# EAGLE design main (EAGLE 8.3.1)
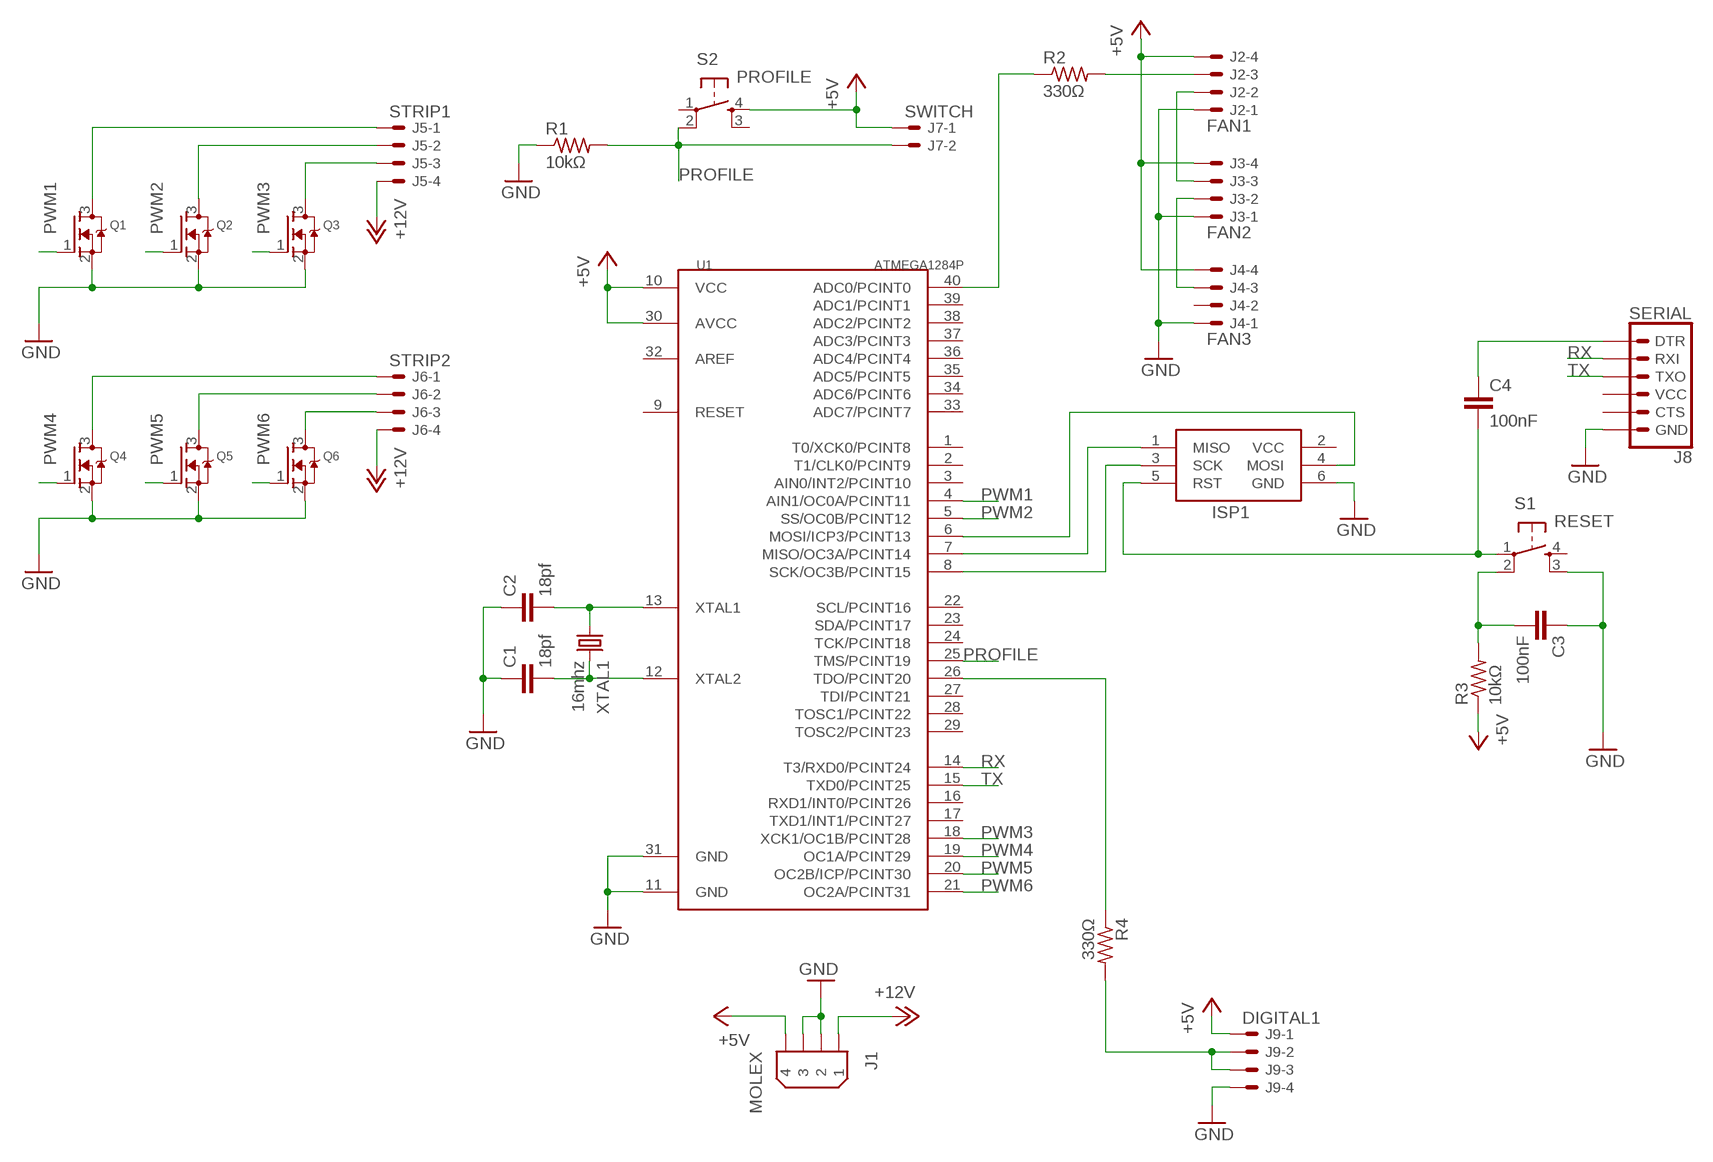
[diagram p0: schematic, sheet 1]

## Parts
C1  18pf  C  [C0805]
C2  18pf  C  [C0805]
C3  100nF  C-EUC0805  [C0805]
C4  100nF  C-EUC0805  [C0805]
ISP1  AVRISP-6  [AVRISP]
J1  MOLEX  9090-4R  [9090-4R]
J2  FAN1  22-23-2041  [22-23-2041]
J3  FAN2  22-23-2041  [22-23-2041]
J4  FAN3  22-23-2041  [22-23-2041]
J5  STRIP1  22-23-2041  [22-23-2041]
J6  STRIP2  22-23-2041  [22-23-2041]
J7  SWITCH  22-23-2021  [22-23-2021]
J8  SERIAL  6_PIN_SERIAL_TARGET  [1X06]
J9  DIGITAL1  22-23-2041  [22-23-2041]
Q1  MOSFET-NREFLOW  [SOT23]
Q2  MOSFET-NREFLOW  [SOT23]
Q3  MOSFET-NREFLOW  [SOT23]
Q4  MOSFET-NREFLOW  [SOT23]
Q5  MOSFET-NREFLOW  [SOT23]
Q6  MOSFET-NREFLOW  [SOT23]
R1  10kΩ  R-US_M0805  [M0805]
R2  330Ω  R-US_M0805  [M0805]
R3  10kΩ  R-US_M0805  [M0805]
R4  330Ω  R-US_M0805  [M0805]
S1  RESET  BUTTON  [B3F-1000]
S2  PROFILE  BUTTON  [B3F-1000]
U1  ATMEGA1284P  MEGA1284P  [DIL40]
XTAL1  16mhz  CRYSTALHC49U-V  [HC49U-V]

## Nets
+5V: J1.4 J2.4 J3.4 J4.4 J7.1 J9.1 R3.1 S2.4(S) U1.10(VCC) U1.30(AVCC)
+12V: J1.1 J5.4 J6.4
DIN-D: J9.2 J9.3 R4.2
DTR: C4.1 J8.1(DTR)
F1-DIN: J2.3 R2.2
F2-DIN: J2.2 J3.3
F3-DIN: J3.2 J4.3
GND: C1.1 C2.1 C3.1 ISP1.6(GND) J1.2 J1.3 J2.1 J3.1 J4.1 J8.6(GND) J9.4 Q1.2(S) Q2.2(S) Q3.2(S) Q4.2(S) Q5.2(S) Q6.2(S) R1.1 S1.3(S1) U1.11(GND) U1.31(GND)
MISO: ISP1.1(MISO) U1.7(MISO/OC3A/PCINT14)
MOSI: ISP1.4(MOSI) U1.6(MOSI/ICP3/PCINT13)
N$1: C2.2 U1.13(XTAL1) XTAL1.1
N$2: C1.2 U1.12(XTAL2) XTAL1.2
N$5: R2.1 U1.40(ADC0/PCINT0)
N$20: R4.1 U1.26(TDO/PCINT20)
PROFILE: J7.2 R1.2 S2.2(P1) U1.25(TMS/PCINT19)
PWM1: Q1.1(G) U1.4(AIN1/OC0A/PCINT11)
PWM2: Q2.1(G) U1.5(SS/OC0B/PCINT12)
PWM3: Q3.1(G) U1.18(XCK1/OC1B/PCINT28)
PWM4: Q4.1(G) U1.19(OC1A/PCINT29)
PWM5: Q5.1(G) U1.20(OC2B/ICP/PCINT30)
PWM6: Q6.1(G) U1.21(OC2A/PCINT31)
RESET: C3.2 C4.2 ISP1.5(RST) R3.2 S1.1(P) S1.2(P1)
RX: J8.2(RXI) U1.14(T3/RXD0/PCINT24)
S1-1: J5.1 Q1.3(D)
S1-2: J5.2 Q2.3(D)
S1-3: J5.3 Q3.3(D)
S2-1: J6.1 Q4.3(D)
S2-2: J6.2 Q5.3(D)
S2-3: J6.3 Q6.3(D)
SCK: ISP1.3(SCK) U1.8(SCK/OC3B/PCINT15)
TX: J8.3(TXO) U1.15(TXD0/PCINT25)
Unconnected: J4.2 J8.4(VCC) J8.5(CTS) S1.4(S) S2.1(P) S2.3(S1) U1.1(T0/XCK0/PCINT8) U1.2(T1/CLK0/PCINT9) U1.3(AIN0/INT2/PCINT10) U1.9(RESET) U1.16(RXD1/INT0/PCINT26) U1.17(TXD1/INT1/PCINT27) U1.22(SCL/PCINT16) U1.23(SDA/PCINT17) U1.24(TCK/PCINT18) U1.27(TDI/PCINT21) U1.28(TOSC1/PCINT22) U1.29(TOSC2/PCINT23) U1.32(AREF) U1.33(ADC7/PCINT7) U1.34(ADC6/PCINT6) U1.35(ADC5/PCINT5) U1.36(ADC4/PCINT4) U1.37(ADC3/PCINT3) U1.38(ADC2/PCINT2) U1.39(ADC1/PCINT1)

## Power pins joined to a net without a drawn wire
VCC: ISP1.2(VCC)

## Library data of the parts
C1 C2 = eagle-ltspice:C: CAPACITOR, European symbol; SPICEMODEL: NONE; SPICEPREFIX: C
C3 C4 = rcl:C-EU: CAPACITOR, European symbol
ISP1 = adafruit:AVRISP: AVR ISP HEADER Standard 6 pin header for AVR programming
J1 = con-thomas-betts:9090-4: Disk Drive Power four position Source: Thomas & Betts Electronic Interconnects Eiropean Edition 1998; OC_FARNELL: unknown; OC_NEWARK: unknown
J2-J6 J9 = con-molex:22-23-2041: .100" (2.54mm) Center Header - 4 Pin; MF: MOLEX; MPN: 22-23-2041; OC_FARNELL: 1462920; OC_NEWARK: 38C0355
J7 = con-molex:22-23-2021: .100" (2.54mm) Center Header - 2 Pin; MF: MOLEX; MPN: 22-23-2021; OC_FARNELL: 1462926; OC_NEWARK: 25C3832
J8 = SparkFun-Connectors:6_PIN_SERIAL_TARGET: 6-pin header connection for use with the "FTDI BASIC" pinout - TARGET SIDE. Also known as "Arduino Serial Program Header". It is used to mate with our FTDI Basic serial programmers using the Arduino IDE. Note, this device has "TARGET" in the name. It is intended to be used on a design that contains a target micro-controller that you wish to program. The "sister" device, named "CABLE" is inteneded to be used on a design that usually lives on the end of your USB cable and prvides the converter chip (FTDI232 or FTDI231x) to commnicate serial RX/TX. You can populate with some of these: Break Away Headers - Straight <https://www.sparkfun.com/products/116> (PRT-00116) For reference (or to suit your programming needs) check out these designs: SparkFun FTDI Basic Breakout - 5V <https://www.sparkfun.com/products/9716> (DEV-09716) SparkFun FTDI Basic Breakout - 3.3V <https://www.sparkfun.com/products/9873> (DEV-09873) SparkFun FTDI SmartBasic <https://www.sparkfun.com/products/12935> (DEV-12935) SparkFun Beefy 3 - FTDI Basic Breakout <https://www.sparkfun.com/products/13746> (DEV-13746)
Q1-Q6 = adafruit:MOSFET-N: N-Channel Mosfet 2N7002E - 60V 260mA SOT23 [Digikey: 2N7002ET1GOSTR-ND] - REEL BSH103 - 30V 850mA SOT23 [Digikey: 568-5013-1-ND]
R1-R4 = adafruit:R-US_: RESISTOR, American symbol
S1 S2 = my_parts:BUTTON
U1 = 1284p:MEGA1284P: Atmel ATmega1284P 8-bit AVR Microcontroller
XTAL1 = adafruit:CRYSTAL: CRYSTAL; OC_FARNELL: 1666969; OC_NEWARK: unknown

## Net classes
0 default: clearance 0.406 mm

## Board
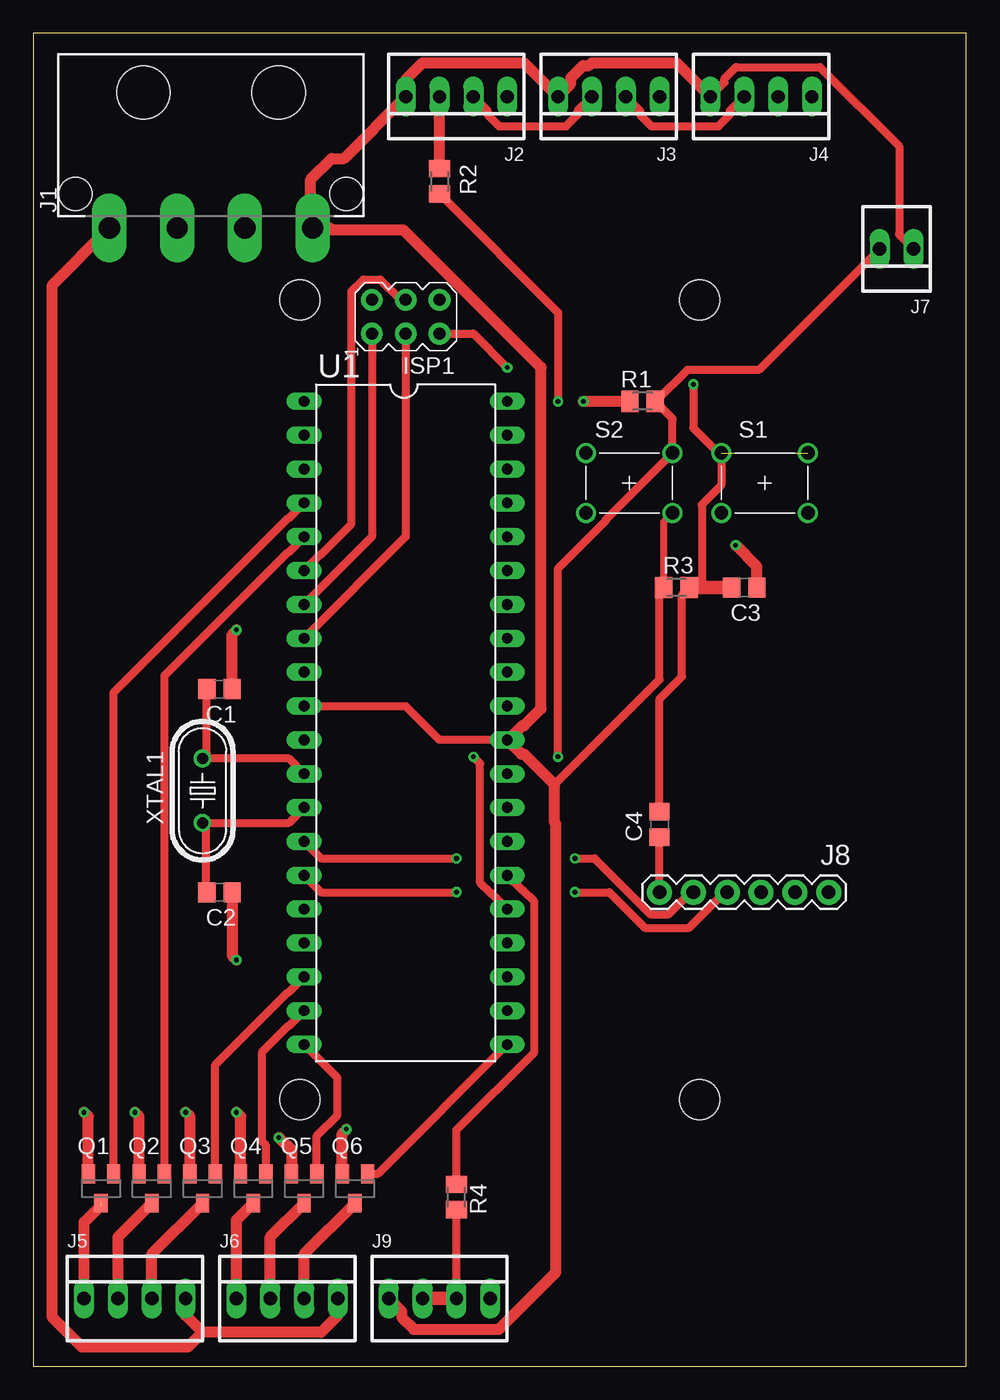
[diagram p1: board, top side]
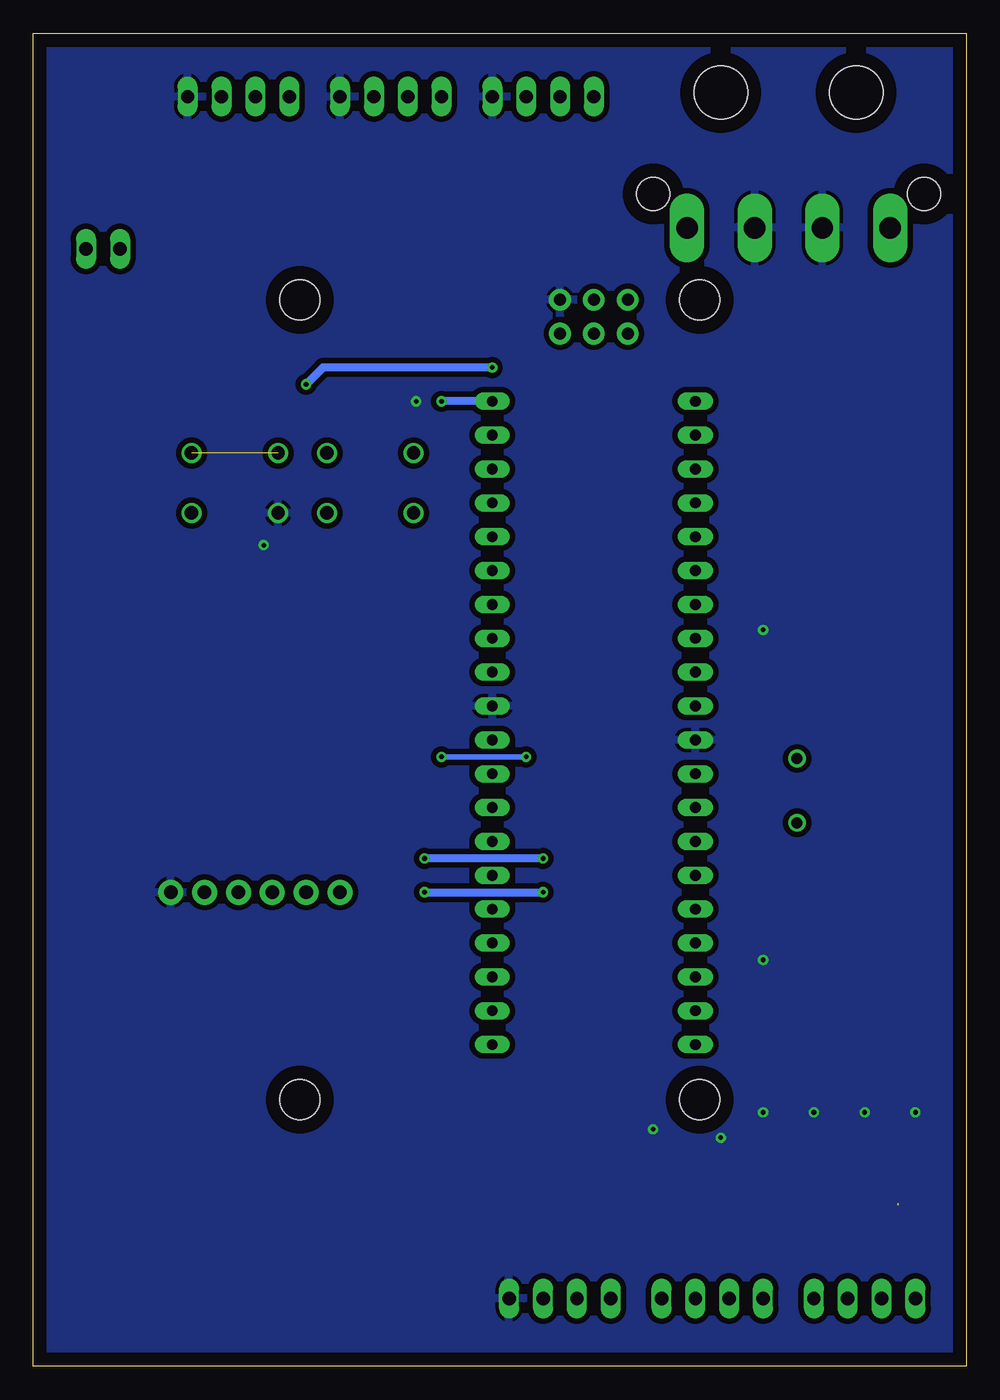
[diagram p2: board, bottom side, seen from below]

Size 70 x 100 mm. Coordinates in mm from the lower left corner, seen from the top.
Outline: 0,0 70,0 70,100 0,100 0,0
Copper layers (1*16): Top 0.035mm / dielectric 1.5mm / Bottom 0.035mm
Design rules "default": minimum track width 6mil, minimum drill 0.35mm, track to track 6mil, track to pad 6mil, pad to pad 6mil, via to via 6mil, smd to smd 6mil, copper to edge 40mil, drill to drill 6mil, minimum pad ring 10mil, minimum via ring 8mil, stop-mask expansion 4mil, vias tented up to drill 0mil, thermal gap 10mil
Holes 3 mm at 20,80 50,80 50,20 20,20

### Footprints (pad centres in the part's own frame; a part is rotated, then mirrored left to right if it is on the bottom)
C0805 = smd 1.3 x 1.5: 1 -0.95,0; 2 0.95,0
AVRISP = drill 0.9 pad 1.626: 1 -1.27,2.54; 2 1.27,2.54; 3 -1.27,0; 4 1.27,0; 5 -1.27,-2.54; 6 1.27,-2.54
9090-4R = drill 1.6 pad 2.6 long: 1 -7.62,-6.35; 2 -2.54,-6.35; 3 2.54,-6.35; 4 7.62,-6.35 | hole 4: -5.08,3.81; 5.08,3.81 | hole 2.5: -10.16,-3.81; 10.16,-3.81
22-23-2041 = drill 1 long: 1 -3.81,0; 2 -1.27,0; 3 1.27,0; 4 3.81,0
22-23-2021 = drill 1 long: 1 -1.27,0; 2 1.27,0
1X06 = drill 1.016 pad 1.88: 1 0,0; 2 2.54,0; 3 5.08,0; 4 7.62,0; 5 10.16,0; 6 12.7,0
SOT23 = smd 1 x 1.4: 1 -0.95,-1.1; 2 0.95,-1.1; 3 0,1.1
M0805 = smd 1.3 x 1.6: 1 -0.95,0; 2 0.95,0
B3F-1000 = drill 1: 1 -4.25,3.75; 2 2.25,3.75; 3 -4.25,-0.75; 4 2.25,-0.75
DIL40 = drill 0.813 long: 1 -24.13,-7.62; 2 -21.59,-7.62; 3 -19.05,-7.62; 4 -16.51,-7.62; 5 -13.97,-7.62; 6 -11.43,-7.62; 7 -8.89,-7.62; 8 -6.35,-7.62; 9 -3.81,-7.62; 10 -1.27,-7.62; 11 1.27,-7.62; 12 3.81,-7.62; 13 6.35,-7.62; 14 8.89,-7.62; 15 11.43,-7.62; 16 13.97,-7.62; 17 16.51,-7.62; 18 19.05,-7.62; 19 21.59,-7.62; 20 24.13,-7.62; 21 24.13,7.62; 22 21.59,7.62; 23 19.05,7.62; 24 16.51,7.62; 25 13.97,7.62; 26 11.43,7.62; 27 8.89,7.62; 28 6.35,7.62; 29 3.81,7.62; 30 1.27,7.62; 31 -1.27,7.62; 32 -3.81,7.62; 33 -6.35,7.62; 34 -8.89,7.62; 35 -11.43,7.62; 36 -13.97,7.62; 37 -16.51,7.62; 38 -19.05,7.62; 39 -21.59,7.62; 40 -24.13,7.62
HC49U-V = drill 0.813: 1 -2.413,0; 2 2.413,0

### Placement (x,y rotation side)
C1  13.97,50.8 180 top
C2  13.97,35.56 180 top
C3  53.34,58.42 180 top
C4  46.99,40.64 90 top
ISP1  27.94,78.74 90 top
J1  13.33,91.75 0 top
J2  31.75,95.25 180 top
J3  43.18,95.25 180 top
J4  54.61,95.25 180 top
J5  7.62,5.08 0 top
J6  19.05,5.08 0 top
J7  64.77,83.82 180 top
J8  46.99,35.56 0 top
J9  30.48,5.08 0 top
Q1  5.08,13.34 180 top
Q2  8.89,13.34 180 top
Q3  12.7,13.34 180 top
Q4  16.51,13.34 180 top
Q5  20.32,13.34 180 top
Q6  24.13,13.34 180 top
R1  45.72,72.39 0 top
R2  30.48,88.9 90 top
R3  48.26,58.42 0 top
R4  31.75,12.7 270 top
S1  55.88,64.77 0 top
S2  45.72,64.77 0 top
U1  27.94,48.26 270 top
XTAL1  12.7,43.18 90 top

### Tracks (layer width: path | path; a pad name or v marks a point on that pad's centre or on a via)
+5V
  Top 0.508: R3.1 47.31,63.36 S2.4
  Top 0.61: U1.10 27.94,49.53 30.48,46.99 U1.30 35.59,46.96 | 39.12,43.64 46.99,51.51 46.99,58.42 R3.1 | J7.1 64.97,84.89 64.97,91.53 59.03,97.47 52.73,97.47 51.88,96.61 51.88,96.33 J4.4
  Top 0.813: J4.4 48.26,97.79 41.91,97.79 41.69,97.57 41.26,97.57 40.34,96.65 40.34,96.22 J3.4 36.83,97.79 29.21,97.79 27.94,96.52 J2.4 23.3,90.61 22.38,90.61 20.82,89.05 20.82,86.83 20.95,86.7 J1.4 22.25,85.4 22.38,85.27 27.76,85.27 38.1,74.93 38.1,49.33 36.83,48.06 36.69,48.06 35.59,46.96 36.63,45.92 36.83,45.92 39.12,43.64 39.12,40.79 39.22,40.69 39.22,7.04 34.94,2.76 28.56,2.76 27.64,3.68 27.64,4.11 J9.1
+12V
  Top 0.813: J6.4 22.86,3.81 21.59,2.54 12.7,2.54 | 12.7,2.54 11.43,3.81 J5.4 | 12.7,2.54 11.58,1.42 3.66,1.42 1.42,3.66 1.42,81.11 J1.1
DIN-D
  Top 0.61: 31.75,5.12 R4.2 | 31.75,5.12 J9.3 | 31.71,5.08 31.75,5.12
  Top 1.016: J9.2 31.71,5.08
DTR
  Top 0.61: J8.1 C4.1
F1-DIN
  Top 0.813: R2.2 J2.3
F2-DIN
  Top 0.61: J2.2 34.09,94.17 34.09,93.89 34.95,93.03 39.98,93.03 40.84,93.89 40.84,94.17 J3.3
F3-DIN
  Top 0.61: J3.2 45.52,94.17 45.52,93.89 46.38,93.03 51.41,93.03 52.27,93.89 52.27,94.17 J4.3
GND  (via drill 0.35)
  Top 0.813: Q1.2 4.13,18.73 v3.81,19.05 | Q2.2 7.94,18.73 v7.62,19.05 | Q3.2 11.75,18.73 v11.43,19.05 | Q4.2 15.56,18.73 v15.24,19.05 | Q5.2 19.37,16.23 18.45,17.14 v18.41,17.14 | Q6.2 23.18,17.46 v23.5,17.78 | C1.1 14.92,54.92 v15.24,55.24 | C2.1 14.92,30.8 v15.24,30.48 | C3.1 54.29,60.01 v52.7,61.59 | v41.27,72.39 R1.1
  pour Bottom: 0,100.33 69.85,100.33 69.85,0 0,0
MISO
  Top 0.61: ISP1.1 25.4,62.23 U1.7
MOSI
  Top 0.61: U1.6 21.49,60.86 21.55,60.86 23.88,63.19 23.88,80.64 24.77,81.53 26.03,81.53 27.55,80.01 ISP1.4
N$1
  Top 0.406: C2.2 12.97,35.61
  Top 0.61: 12.97,40.77 XTAL1.1 | 12.97,40.77 19.18,40.77 U1.13 | 12.97,35.61 12.97,40.77
N$2
  Top 0.406: XTAL1.2 13.02,45.91
  Top 0.61: U1.12 19.18,45.59 XTAL1.2 | 13.02,45.91 C1.2
N$5  (via drill 0.35)
  Top 0.61: R2.1 39.37,79.06 v39.37,72.39
  Bottom 0.61: U1.40 v39.37,72.39
N$20
  Top 0.61: R4.1 31.75,17.72 37.59,23.56 37.59,34.86 36.79,35.66 36.73,35.66 U1.26
PROFILE  (via drill 0.35)
  Top 0.406: S2.2 47.83,68.66 47.83,68.19
  Top 0.61: J7.2 54.43,74.75 49.08,74.75 46.72,72.39 R1.2 47.73,71.33 | 47.73,71.33 47.83,71.23 | v33.02,45.72 33.53,45.21 33.53,36.26 34.33,35.46 34.39,35.46 U1.25 | v39.37,45.72 39.37,59.85 42.94,63.41 42.94,63.48 S2.2 47.97,71.09 47.73,71.33
  Bottom 0.406: v33.02,45.72 v39.37,45.72
PWM1
  Top 0.61: U1.4 19.15,63.6 19.09,63.6 6.03,50.54 Q1.1
PWM2
  Top 0.61: U1.5 19.15,61.06 19.09,61.06 9.84,51.81 Q2.1
PWM3
  Top 0.61: U1.18 19.15,28.04 19.09,28.04 13.65,22.6 Q3.1
PWM4
  Top 0.61: Q4.1 17.46,16.56 17.18,16.84 17.18,23.59 19.09,25.5 19.15,25.5 U1.19
PWM5
  Top 0.61: Q5.1 21.27,17.28 22.82,18.83 22.82,21.63 U1.20
PWM6
  Top 0.61: Q6.1 25.86,14.44 U1.21
RESET  (via drill 0.35)  (1 unrouted)
  Top 0.406: 51.63,68.3 S1.1
  Top 0.508: R3.2 49.79,58.42
  Top 0.61: ISP1.5 33.02,77.47 v35.56,74.93 | v49.53,73.66 49.53,70.4 51.63,68.3 | S1.1 51.63,66.09 50.16,64.63 50.16,58.8 49.79,58.42 | C4.2 46.99,50.08 48.67,51.76 48.67,57.88 R3.2
  Top 1.016: 49.79,58.42 C3.2
  Bottom 0.61: v35.56,74.93 48.26,74.93 v49.53,73.66
RX  (via drill 0.35)
  Top 0.61: U1.14 21.59,38.1 v31.75,38.1 | v40.64,38.1 42.12,38.1 46.31,33.91 47.67,33.91 49.33,35.56 J8.2
  Bottom 0.61: v31.75,38.1 v40.64,38.1
S1-1  (1 unrouted)
  Top 0.813: J5.1 3.81,10.79 5.08,12.06
S1-2
  Top 0.813: J5.2 6.35,9.7 Q2.3
S1-3
  Top 0.813: J5.3 8.89,8.43 Q3.3
S2-1
  Top 0.813: J6.1 15.24,10.96 Q4.3
S2-2
  Top 0.813: J6.2 17.78,9.7 Q5.3
S2-3
  Top 0.813: J6.3 20.32,8.43 Q6.3
SCK
  Top 0.61: ISP1.3 27.94,62.23 U1.8
TX  (via drill 0.35)
  Top 0.406: J8.3 51.72,35.56
  Top 0.61: U1.15 21.59,35.56 v31.75,35.56 | 51.87,35.56 J8.3 51.87,35.56 | v40.64,35.56 43.22,35.56 45.88,32.89 49.2,32.89 51.87,35.56
  Bottom 0.61: v40.64,35.56 v31.75,35.56